# Altium schematic sheet ultrasonic.SchDoc
size A4
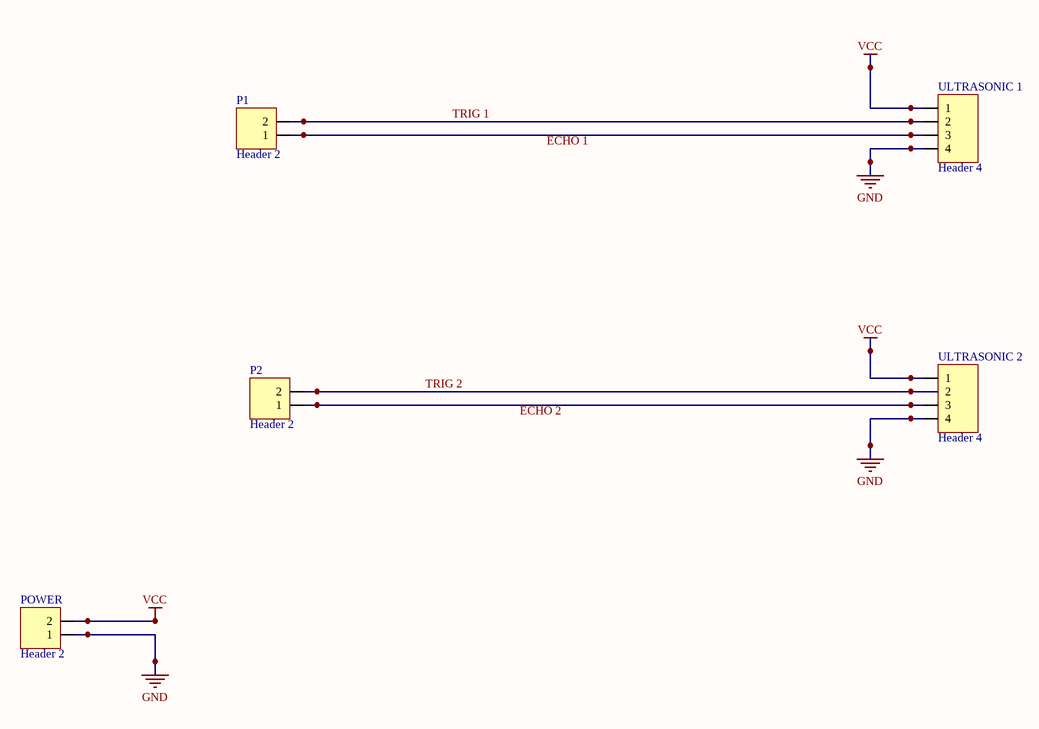
[diagram p0: ultrasonic.SchDoc]

## Parts
P1  Header 2  [HDR1X2]
P2  Header 2  [HDR1X2]
POWER  Header 2  [HDR1X2]
ULTRASONIC_1  Header 4  [HDR1X4]
ULTRASONIC_2  Header 4  [HDR1X4]

## Nets
GND: POWER.1 ULTRASONIC_1.4 ULTRASONIC_2.4
VCC: POWER.2 ULTRASONIC_1.1 ULTRASONIC_2.1
TRIG 1: P1.2 ULTRASONIC_1.2
TRIG 2: P2.2 ULTRASONIC_2.2
NetP1_1: P1.1 ULTRASONIC_1.3
NetP2_1: P2.1 ULTRASONIC_2.3

## Notes on the sheet
- Labels drawn without touching a wire or pin: ECHO 1, ECHO 2

## Library data of the parts
P1 P2 POWER = Header 2: Header, 2-Pin; LatestRevisionDate: 17-Jul-2002; LatestRevisionNote: Re-released for DXP Platform.; Publisher: Altium Limited
ULTRASONIC_1 ULTRASONIC_2 = Header 4: Header, 4-Pin; LatestRevisionDate: 17-Jul-2002; LatestRevisionNote: Re-released for DXP Platform.; Publisher: Altium Limited